# EAGLE design MainsFreqMon_RevA (EAGLE 7.2.0)
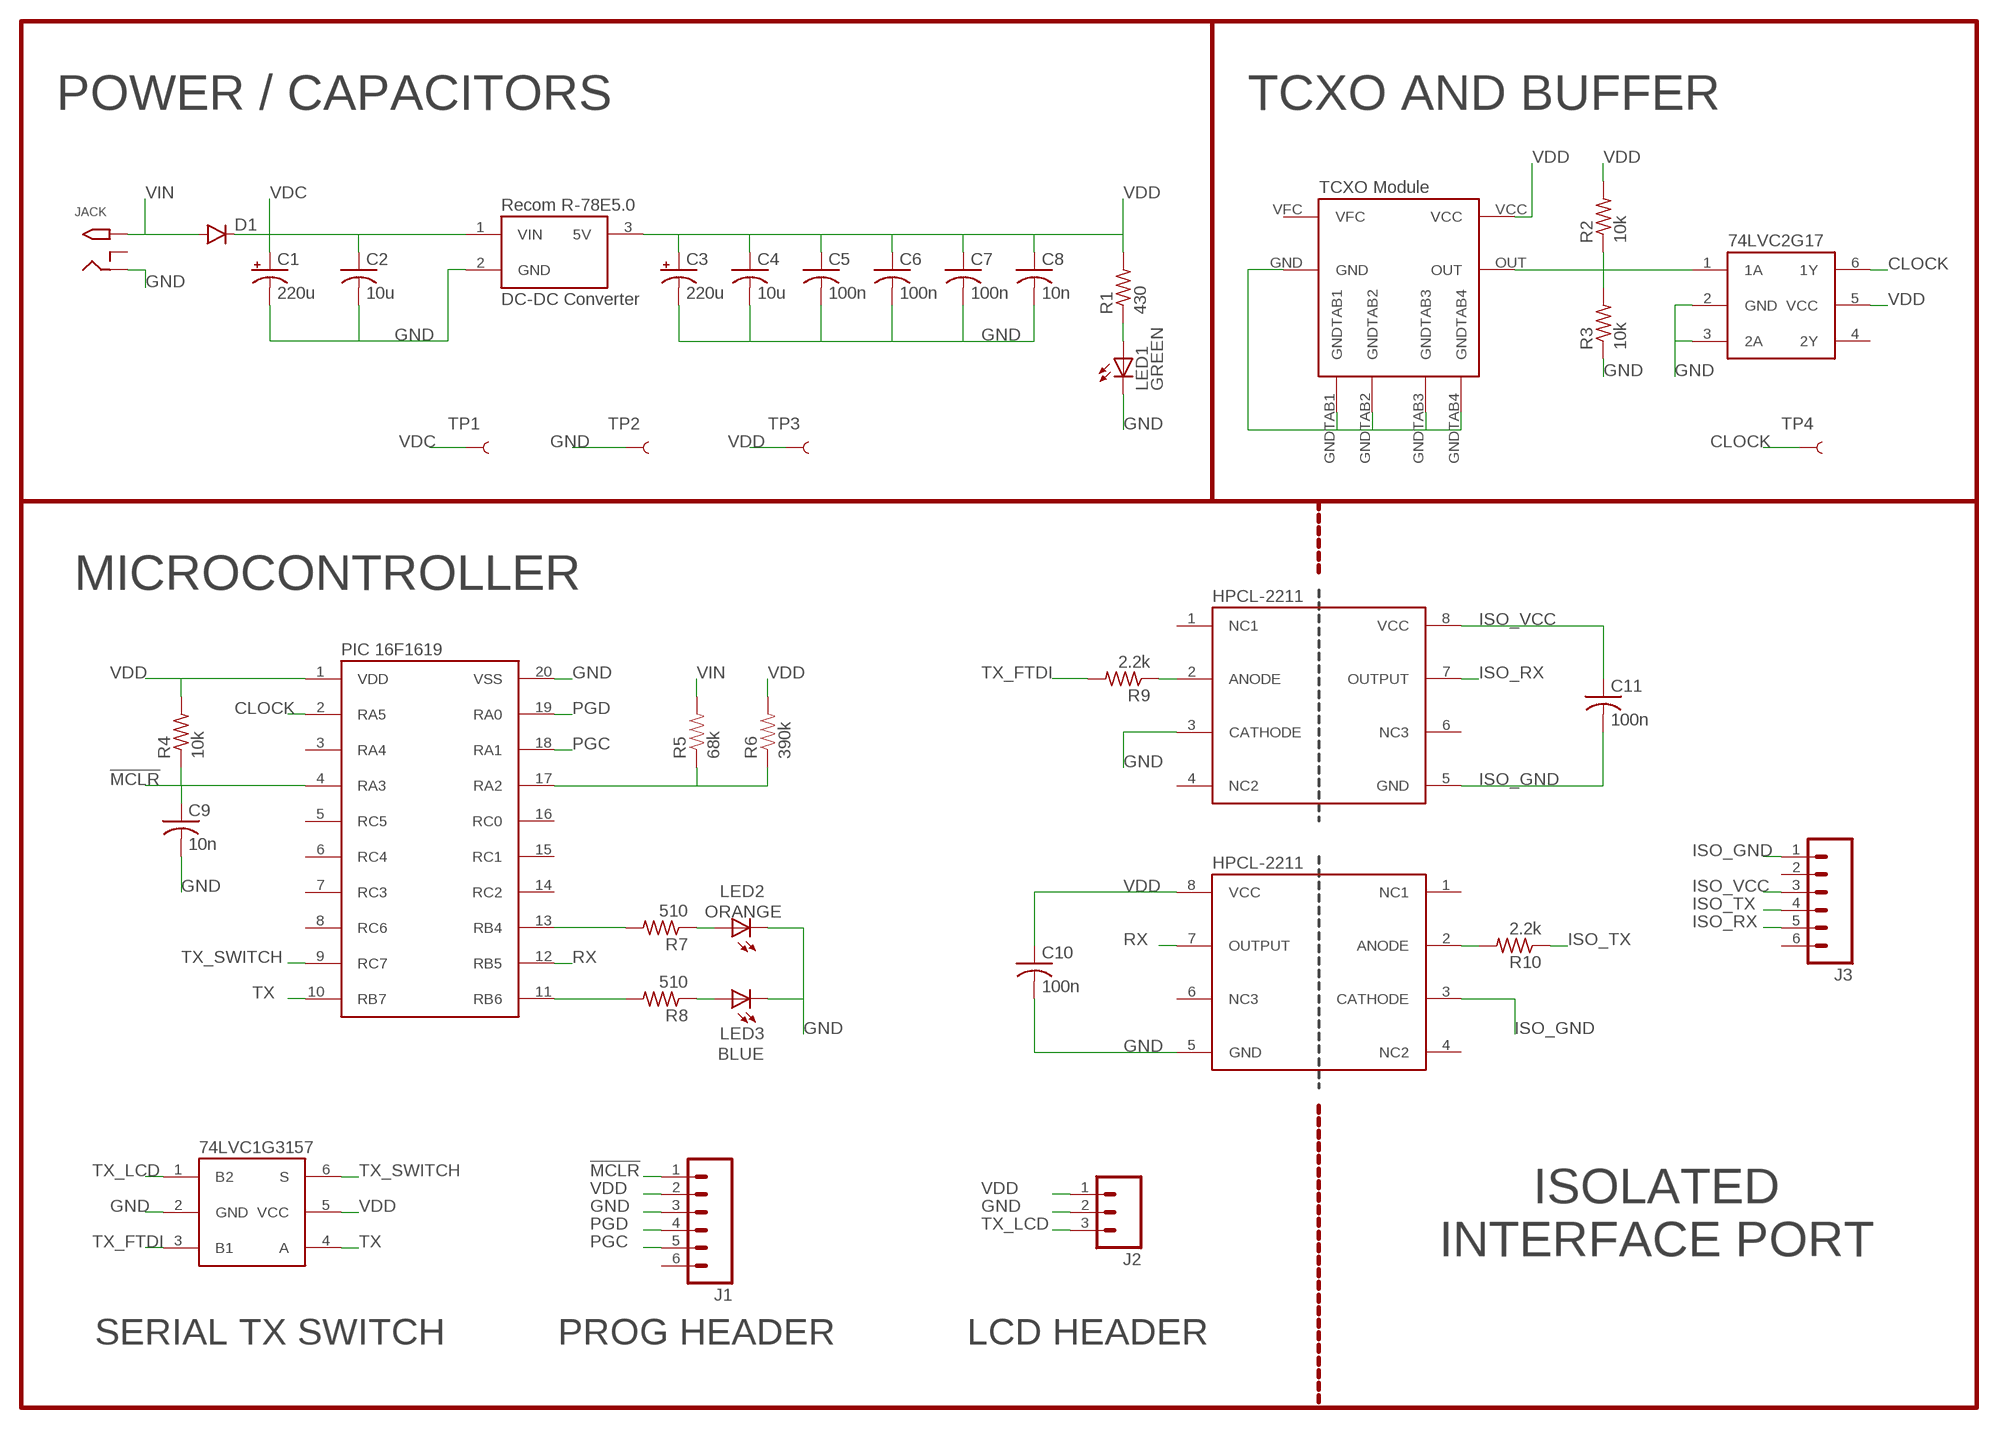
[diagram p0: schematic, sheet 1]

## Parts
C1  220u  CPOL-USE3.5-8  [E3,5-8]
C2  10u  C-USC0805  [C0805]
C3  220u  CPOL-USE3.5-8  [E3,5-8]
C4  10u  C-USC0805  [C0805]
C5  100n  C-USC0805  [C0805]
C6  100n  C-USC0805  [C0805]
C7  100n  C-USC0805  [C0805]
C8  10n  C-USC0805  [C0805]
C9  10n  C-USC0805  [C0805]
C10  100n  C-USC0805  [C0805]
C11  100n  C-USC0805  [C0805]
D1  DIODEPTH  [DIODE-1N4001]
J1  M06SILK_FEMALE_PTH  [1X06]
J2  M03PTH  [1X03]
J3  M06SILK_FEMALE_PTH  [1X06]
JACK  2.1MMJACKTHM  [PJ-102A]
LED1  GREEN  LEDCHIPLED_1206  [CHIPLED_1206]
LED2  ORANGE  LEDCHIPLED_1206  [CHIPLED_1206]
LED3  BLUE  LEDCHIPLED_1206  [CHIPLED_1206]
R1  430  R-US_R0805  [R0805]
R2  10k  R-US_R0805  [R0805]
R3  10k  R-US_R0805  [R0805]
R4  10k  R-US_R0805  [R0805]
R5  68k  RESISTORPTH-1/4W  [AXIAL-0.4]
R6  390k  RESISTORPTH-1/4W  [AXIAL-0.4]
R7  510  R-US_R0805  [R0805]
R8  510  R-US_R0805  [R0805]
R9  2.2k  R-US_R0805  [R0805]
R10  2.2k  R-US_R0805  [R0805]
RG1  R-78C5.0  [R-78C5.0]
TP1  TEST-POINT3X5  [PAD.03X.05]
TP2  TEST-POINT3X5  [PAD.03X.05]
TP3  TEST-POINT3X5  [PAD.03X.05]
TP4  TEST-POINT3X5  [PAD.03X.05]
U1  16F1619  [SO20L]
U2  74LVC2G14/7  [SOT23-6]
U3  74LVC1G3157  [SOT23-6]
U4  HPCL2211  [DIP08]
U5  HPCL2211  [DIP08]
X1  TCXO2  [TCXO2]

## Nets
!MCLR: C9.1 J1.1 R4.1 U1.4(RA3)
CLOCK: TP4.P$1 U1.2(RA5) U2.6(1Y)
GND: C1.- C2.2 C3.- C4.2 C5.2 C6.2 C7.2 C8.2 C9.2 C10.2 J1.3 J2.2 JACK.RING LED1.C LED2.C LED3.C R3.1 RG1.2(GND) TP2.P$1 U1.20(VSS) U2.2(GND) U2.3(2A) U3.2(GND) U4.3(CATHODE) U5.5(GND) X1.GND X1.GNDTAB1 X1.GNDTAB2 X1.GNDTAB3 X1.GNDTAB4
ISO_GND: C11.2 J3.1 U4.5(GND) U5.3(CATHODE)
ISO_RX: J3.5 U4.7(OUTPUT)
ISO_TX: J3.4 R10.1
ISO_VCC: C11.1 J3.3 U4.8(VCC)
N$1: R9.1 U4.2(ANODE)
N$2: LED1.A R1.1
N$4: R10.2 U5.2(ANODE)
N$5: R7.2 U1.13(RB4)
N$6: R2.1 R3.2 U2.1(1A) X1.OUT
N$7: R8.2 U1.11(RB6)
N$8: LED2.A R7.1
N$9: LED3.A R8.1
N$10: R5.P$1 R6.P$1 U1.17(RA2)
PGC: J1.5 U1.18(RA1)
PGD: J1.4 U1.19(RA0)
RX: U1.12(RB5) U5.7(OUTPUT)
TX: U1.10(RB7) U3.4(A)
TX_FTDI: R9.2 U3.3(B1)
TX_LCD: J2.3 U3.1(B2)
TX_SWITCH: U1.9(RC7) U3.6(S)
VDC: C1.+ C2.1 D1.C RG1.1(VIN) TP1.P$1
VDD: C3.+ C4.1 C5.1 C6.1 C7.1 C8.1 C10.1 J1.2 J2.1 R1.2 R2.2 R4.2 R6.P$2 RG1.3(5V) TP3.P$1 U1.1(VDD) U2.5(VCC) U3.5(VCC) U5.8(VCC) X1.VCC
VIN: D1.A JACK.TIP R5.P$2
Unconnected: J1.6 J3.2 J3.6 JACK.RING_SW U1.3(RA4) U1.5(RC5) U1.6(RC4) U1.7(RC3) U1.8(RC6) U1.14(RC2) U1.15(RC1) U1.16(RC0) U2.4(2Y) U4.1(NC1) U4.4(NC2) U4.6(NC3) U5.1(NC1) U5.4(NC2) U5.6(NC3) X1.VFC

## Notes on the sheet
- POWER / CAPACITORS | TCXO AND BUFFER
- TCXO Module
- Recom R-78E5.0
- 74LVC2G17
- DC-DC Converter
- MICROCONTROLLER
- HPCL-2211
- PIC 16F1619
- HPCL-2211
- 74LVC1G3157
- ISOLATED
  INTERFACE PORT
- SERIAL TX SWITCH | PROG HEADER | LCD HEADER

## Library data of the parts
C1 C3 = adafruit:CPOL-US: POLARIZED CAPACITOR, American symbol
C2 C4-C11 = adafruit:C-US: CAPACITOR, American symbol
D1 = SparkFun-DiscreteSemi:DIODE: Diode These are standard reverse protection diodes and small signal diodes. SMA package can handle up to about 1A. SOD-323 can handle about 200mA. What the SOD-323 package when ordering, there are some mfgs out there that are 5-pin packages.
J1 = SparkFun-ConnectorsNEW:M06: Header 6 Standard 6-pin 0.1" header. Use with straight break away headers (SKU : PRT-00116), right angle break away headers (PRT-00553), swiss pins (PRT-00743), machine pins (PRT-00117), and female headers (PRT-00115). Molex polarized connector foot print use with SKU : PRT-08094 with associated crimp pins and housings. NOTES ON THE VARIANTS LOCK and LOCK_LONGPADS... This footprint was designed to help hold the alignment of a through-hole component (i.e. 6-pin header) while soldering it into place. You may notice that each hole has been shifted either up or down by 0.005 of an inch from it's more standard position (which is a perfectly straight line). This slight alteration caused the pins (the squares in the middle) to touch the edges of the holes. Because they are alternating, it causes a "brace" to hold the component in place. 0.005 has proven to be the perfect amount of "off-center" position when using our standard breakaway headers. Although looks a little odd when you look at the bare footprint, once you have a header in there, the alteration is very hard to notice. Also,if you push a header all the way into place, it is covered up entirely on the bottom side. This idea of altering the position of holes to aid alignment will be further integrated into the Sparkfun Library for other footprints. It can help hold any component with 3 or more connection pins.; PROD_ID: CONN-08437
J2 = SparkFun-Connectors:M03: Header 3 Standard 3-pin 0.1" header. Use with straight break away headers (SKU : PRT-00116), right angle break away headers (PRT-00553), swiss pins (PRT-00743), machine pins (PRT-00117), and female headers (PRT-00115). Molex polarized connector foot print use with SKU : PRT-08232 with associated crimp pins and housings.
J3 = SparkFun-Connectors:M06: Header 6 Standard 6-pin 0.1" header. Use with straight break away headers (SKU : PRT-00116), right angle break away headers (PRT-00553), swiss pins (PRT-00743), machine pins (PRT-00117), and female headers (PRT-00115). Molex polarized connector foot print use with SKU : PRT-08094 with associated crimp pins and housings. NOTES ON THE VARIANTS LOCK and LOCK_LONGPADS... This footprint was designed to help hold the alignment of a through-hole component (i.e. 6-pin header) while soldering it into place. You may notice that each hole has been shifted either up or down by 0.005 of an inch from it's more standard position (which is a perfectly straight line). This slight alteration caused the pins (the squares in the middle) to touch the edges of the holes. Because they are alternating, it causes a "brace" to hold the component in place. 0.005 has proven to be the perfect amount of "off-center" position when using our standard breakaway headers. Although looks a little odd when you look at the bare footprint, once you have a header in there, the alteration is very hard to notice. Also,if you push a header all the way into place, it is covered up entirely on the bottom side. This idea of altering the position of holes to aid alignment will be further integrated into the Sparkfun Library for other footprints. It can help hold any component with 3 or more connection pins.; PROD_ID: CONN-08437
JACK = adafruit:2.1MMJACK: 2.1mm x 5.5mm THM DC jack with internal switch. Digikey part #PJ-102A, 4UCON part #05537 2.1mm x 5.5mm SMT DC jack with internal switch. Digikey part #PJ-002A-SMT, 4UCON part #03267 By microbuilder.eu & adafruit.com
LED1-LED3 = adafruit:LED: LED OSRAM: - CHIPLED LG R971, LG N971, LY N971, LG Q971, LY Q971, LO R971, LY R971 LH N974, LH R974 LS Q976, LO Q976, LY Q976 LO Q996 - Hyper CHIPLED LW Q18S LB Q993, LB Q99A, LB R99A - SideLED LS A670, LO A670, LY A670, LG A670, LP A670 LB A673, LV A673, LT A673, LW A673 LH A674 LY A675 LS A676, LA A676, LO A676, LY A676, LW A676 LS A679, LY A679, LG A679 - Hyper Micro SIDELED® LS Y876, LA Y876, LO Y876, LY Y876 LT Y87S - SmartLED LW L88C, LW L88S LB L89C, LB L89S, LG L890 LS L89K, LO L89K, LY L89K LS L896, LA L896, LO L896, LY L896 - TOPLED LS T670, LO T670, LY T670, LG T670, LP T670 LSG T670, LSP T670, LSY T670, LOP T670, LYG T670 LG T671, LOG T671, LSG T671 LB T673, LV T673, LT T673, LW T673 LH T674 LS T676, LA T676, LO T676, LY T676, LB T676, LH T676, LSB T676, LW T676 LB T67C, LV T67C, LT T67C, LS T67K, LO T67K, LY T67K, LW E67C LS E67B, LA E67B, LO E67B, LY E67B, LB E67C, LV E67C, LT E67C LW T67C LS T679, LY T679, LG T679 LS T770, LO T770, LY T770, LG T770, LP T770 LB T773, LV T773, LT T773, LW T773 LH T774 LS E675, LA E675, LY E675, LS T675 LS T776, LA T776, LO T776, LY T776, LB T776 LHGB T686 LT T68C, LB T68C - Hyper Mini TOPLED® LB M676 - Mini TOPLED Santana® LG M470 LS M47K, LO M47K, LY M47K Source: http://www.osram.convergy.de/
R1-R4 R7-R10 = adafruit:R-US_: RESISTOR, American symbol
R5 R6 = SparkFun-Resistors:RESISTOR: Resistor Basic schematic elements and footprints for 0603, 1206, and PTH resistors.
RG1 = _CustomParts:R-78C5.0
TP1-TP4 = SparkFun-Passives:TEST-POINT: Bare copper test points for troubleshooting or ICT
U1 = _CustomParts:16F1619
U2 = _CustomParts:74LVC2G14/7
U3 = _CustomParts:74LVC1G3157
U4 U5 = _CustomParts:HPCL2211
X1 = _CustomParts:TCXO2

## Board
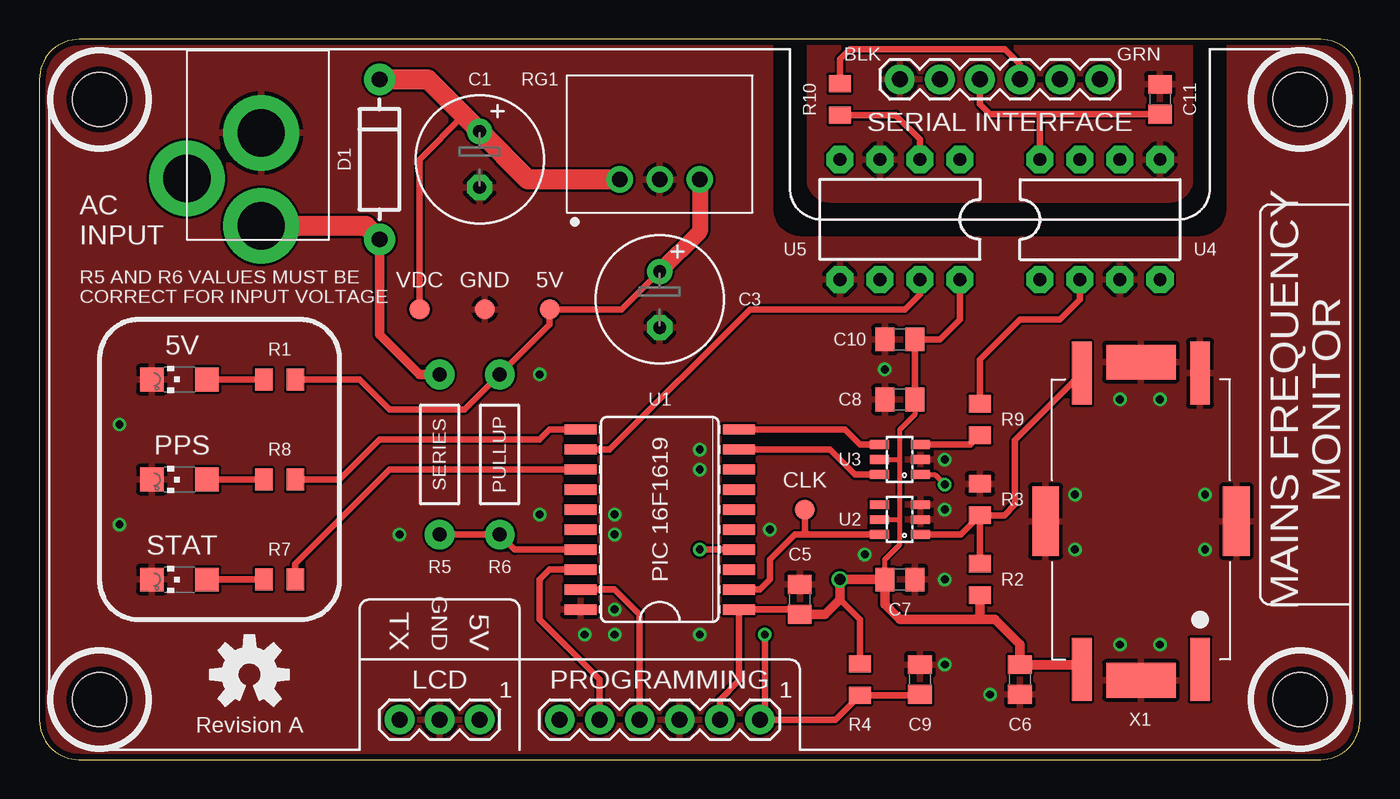
[diagram p1: board, top side]
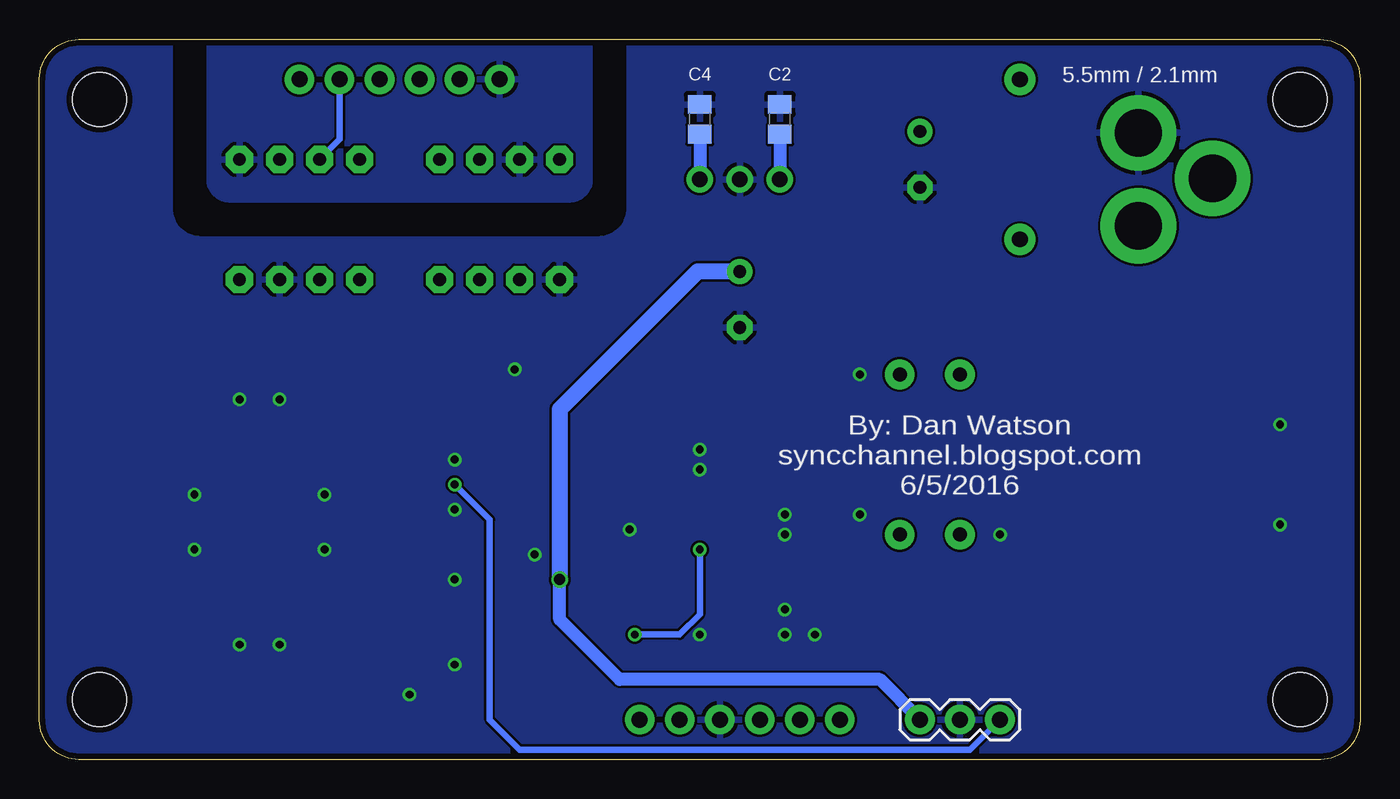
[diagram p2: board, bottom side, seen from below]

Size 83.82 x 45.72 mm. Coordinates in mm from the lower left corner, seen from the top.
Outline: 81.32,45.72 2.54,45.72 arc90 0,43.18 0,2.5 arc90 2.5,0 81.32,0 arc90 83.82,2.5 83.82,43.22 arc90 81.32,45.72
Copper layers (1*16): Top 0.0356mm / dielectric 1.5011mm / Bottom 0.0356mm
Design rules "oshpark-2layer *": minimum track width 6mil, minimum drill 13mil, track to track 6mil, track to pad 6mil, pad to pad 6mil, via to via 6mil, smd to smd 6mil, copper to edge 15mil, drill to drill 6mil, minimum pad ring 7mil, minimum via ring 7mil, stop-mask expansion 4mil, vias tented up to drill 20mil, thermal gap 10mil
Holes 3.4 mm at 3.81,41.91 80.01,41.91 80.01,3.81 3.81,3.81

### Footprints (pad centres in the part's own frame; a part is rotated, then mirrored left to right if it is on the bottom)
E3,5-8 = drill 0.813 pad 1.6: + -1.778,0 | drill 0.813 pad 1.6 octagon: - 1.778,0
C0805 = smd 1.2 x 1.5: 1 -0.95,0; 2 0.95,0
DIODE-1N4001 = drill 1 pad 1.981: A -5.08,0; C 5.08,0
1X06 = drill 1.016 pad 1.88: 1 0,0; 2 2.54,0; 3 5.08,0; 4 7.62,0; 5 10.16,0; 6 12.7,0
1X03 = drill 1.016 pad 1.88: 1 0,0; 2 2.54,0; 3 5.08,0
PJ-102A = drill 3 pad 4.8: RING 0.1,-3.39; RING_SW -4.6,-6.29; TIP 0.1,-9.29
CHIPLED_1206 = smd 1.5 x 1.5: A 0,-1.75; C 0,1.75
R0805 = smd 1.1 x 1.4: 1 -1,0; 2 1,0
AXIAL-0.4 = drill 0.9 pad 1.88: P$1 -5.08,0; P$2 5.08,0
R-78C5.0 = drill 1 pad 1.676: 1 -2.54,0; 2 0,0; 3 2.54,0
PAD.03X.05 = smd 1.27 x 1.27: P$1 0,0
SO20L = smd 0.66 x 2.032: 1 -5.715,-5.029; 2 -4.445,-5.029; 3 -3.175,-5.029; 4 -1.905,-5.029; 5 -0.635,-5.029; 6 0.635,-5.029; 7 1.905,-5.029; 8 3.175,-5.029; 9 4.445,-5.029; 10 5.715,-5.029; 11 5.715,5.029; 12 4.445,5.029; 13 3.175,5.029; 14 1.905,5.029; 15 0.635,5.029; 16 -0.635,5.029; 17 -1.905,5.029; 18 -3.175,5.029; 19 -4.445,5.029; 20 -5.715,5.029
SOT23-6 = smd 0.55 x 1.2: 1 -0.95,-1.3; 2 0,-1.3; 3 0.95,-1.3; 4 0.95,1.3; 5 0,1.3; 6 -0.95,1.3
DIP08 = drill 0.813 pad 1.727 octagon: 1 -3.81,-3.81; 2 -1.27,-3.81; 3 1.27,-3.81; 4 3.81,-3.81; 5 3.81,3.81; 6 1.27,3.81; 7 -1.27,3.81; 8 -3.81,3.81
TCXO2 = smd 1.25 x 4: GND 0,-0.4; OUT 7.5,-0.4; VCC 7.5,18.4; VFC 0,18.4 | smd 4.4 x 2.2: GNDTAB1 3.75,19.1; GNDTAB3 3.75,-1.1 | smd 1.7 x 4.4: GNDTAB2 -2.3,9; GNDTAB4 9.8,9

### Placement (x,y rotation side)
C1  27.94,38.1 270 top
C2  36.83,40.64 90 bottom
C3  39.37,29.21 270 top
C4  41.91,40.64 90 bottom
C5  48.26,10.16 90 top
C6  62.23,5.08 270 top
C7  54.61,11.43 0 top
C8  54.61,22.86 180 top
C9  55.88,5.08 90 top
C10  54.61,26.67 180 top
C11  71.12,41.91 90 top
D1  21.59,38.1 90 top
J1  45.72,2.54 180 top
J2  27.94,2.54 180 top
J3  54.61,43.18 0 top
JACK  13.97,43.18 0 top
LED1  8.89,24.13 90 top
LED2  8.89,11.43 90 top
LED3  8.89,17.78 90 top
R1  15.24,24.13 0 top
R2  59.69,11.43 270 top
R3  59.69,16.51 270 top
R4  52.07,5.08 90 top
R5  25.4,19.37 90 top
R6  29.21,19.37 90 top
R7  15.24,11.43 0 top
R8  15.24,17.78 0 top
R9  59.69,21.59 270 top
R10  50.8,41.91 270 top
RG1  39.37,36.83 0 top
TP1  24.13,28.57 0 top
TP2  28.26,28.57 0 top
TP3  32.38,28.57 0 top
TP4  48.58,15.88 0 top
U1  39.37,15.24 90 top
U2  54.61,15.24 90 top
U3  54.61,19.05 90 top
U4  67.31,34.29 0 top
U5  54.61,34.29 180 top
U$1  [OSHW-LOGO-M]  13.34,5.4 0 top
X1  73.66,24.13 180 top

### Tracks (layer width: path | path; a pad name or v marks a point on that pad's centre or on a via)
!MCLR  (via drill 0.5)
  Top 0.406: C9.1 55.83,4.08 R4.1 50.53,2.54 J1.1 46.04,3.17 v46.04,7.94 | U1.4 v41.91,13.34
  Bottom 0.406: v41.91,13.34 41.91,9.21 43.18,7.94 v46.04,7.94
CLOCK
  Top 0.406: 48.58,14.29 U2.6 | TP4.P$1 48.58,14.29 | U1.2 45.72,10.79 46.35,11.43 46.35,12.7 47.94,14.29 48.58,14.29
GND  (via drill 0.5)
  other vias: 57.47,19.05 57.47,15.88 34.61,7.94 36.51,7.94 36.51,9.53 52.39,13.02 57.47,11.43 57.47,6.03 53.66,24.77 68.58,22.86 71.12,22.86 71.12,7.3 68.58,7.3 65.72,13.34 65.72,16.83 73.98,16.83 73.98,13.34 5.08,21.27 5.08,14.92 46.35,14.61 41.91,7.94 41.91,19.68 41.91,18.41 31.75,15.56 31.75,24.45 22.86,14.29 36.51,15.56 36.51,14.29 60.33,4.13
  pour Top: 46.35,46.99 46.35,35.02 arc90 48.35,33.02 73.56,33.02 arc90 75.56,35.02 75.56,46.99 85.09,46.99 85.09,-3.81 -2.54,-3.81 -2.54,46.99
  pour Bottom: 46.35,46.99 -2.54,46.99 -2.54,-3.81 85.09,-3.81 85.09,46.99 75.56,46.99 75.56,35.02 arc-90 73.56,33.02 48.35,33.02 arc-90 46.35,35.02
ISO_GND
  pour Bottom: 48.9,46.99 48.9,36.83 arc90 50.16,35.56 71.75,35.56 arc90 73.03,36.83 73.03,46.99
  pour Top: 48.9,46.99 48.9,36.83 arc90 50.16,35.56 71.75,35.56 arc90 73.03,36.83 73.03,46.99
ISO_RX
  Bottom 0.406: J3.5 64.77,39.37 U4.7
ISO_TX
  Top 0.406: J3.4 62.23,44.13 61.28,45.09 51.44,45.09 50.8,44.45 R10.1
ISO_VCC
  Top 0.406: C11.1 63.5,40.96 | 63.5,40.96 60.32,40.96 59.69,41.59 J3.3 | U4.8 63.5,40.96
N$1
  Top 0.406: U4.2 66.04,29.21 64.77,27.94 62.23,27.94 59.69,25.4 R9.1
N$2
  Top 0.406: LED1.A R1.1
N$4
  Top 0.406: R10.2 54.34,40.91 55.88,39.37 U5.2
N$5
  Top 0.406: U1.13 22.23,18.41 16.24,12.43 R7.2
N$6
  Top 0.406: R3.2 61.23,15.51 61.91,16.19 61.91,20.28 X1.OUT | R2.1 R3.2 | U2.1 58.47,14.29 R3.2
N$7
  Top 0.406: R8.2 19.05,17.78 21.59,20.32 31.75,20.32 32.38,20.95 U1.11
N$8
  Top 0.406: LED2.A R7.1
N$9
  Top 0.406: LED3.A R8.1
N$10
  Top 0.406: U1.17 30.16,13.34 R6.P$1 R5.P$1
PGC
  Top 0.406: U1.18 32.38,12.06 31.75,11.43 31.75,8.89 35.56,5.08 J1.5
PGD
  Top 0.406: U1.19 36.51,10.79 38.1,9.21 J1.4
RX
  Top 0.406: U5.7 55.88,29.53 54.93,28.57 45.09,28.57 36.2,19.68 U1.12
TX
  Top 0.406: U1.10 51.12,20.95 52.07,20 U3.4
TX_FTDI
  Top 0.406: U3.3 59.1,20 R9.2
TX_LCD  (via drill 0.5)
  Top 0.305: U3.1 56.83,18.1 v57.47,17.46
  Bottom 0.406: J2.3 24.77,0.64 53.34,0.64 55.24,2.54 55.24,15.24 v57.47,17.46
TX_SWITCH
  Top 0.406: U1.9 50.16,19.68 51.75,18.1 U3.6
VDC
  Top 0.406: TP1.P$1 24.13,38.1 26.92,40.89
  Top 1.27: D1.C 24.64,43.18 26.92,40.89 C1.+ 30.99,36.83 RG1.1
  Bottom 0.813: C2.1 RG1.1
VDD  (via drill 0.7)
  Top 0.305: C7.1 53.66,12.7 54.61,13.65 54.61,15.24 | C8.1 55.56,21.91 54.61,20.95 54.61,19.05 | 54.61,15.24 54.61,19.05 | U3.5 54.61,19.05 | U2.5 54.61,15.24
  Top 0.406: C3.+ 36.96,28.57 TP3.P$1 32.38,27.62 R6.P$2 26.99,22.23 22.23,22.23 20.32,24.13 R1.2 | U5.8 58.42,27.94 57.15,26.67 C10.1 C8.1 | C5.1 47.95,9.53 U1.1 44.4,5.03 43.18,3.81 J1.2 | R4.2 52.07,8.89 50.8,10.16
  Top 0.61: X1.VCC 65.86,6.03 C6.1 62.23,7.3 60.64,8.89 59.69,8.89 | 59.69,8.89 R2.2 | 59.69,8.89 54.61,8.89 53.66,9.84 C7.1 v50.8,11.43 50.8,10.16 49.85,9.21 C5.1
  Top 1.016: RG1.3 41.91,33.53 C3.+
  Bottom 0.813: C4.1 RG1.3 | J2.1 30.48,5.08 46.99,5.08 50.8,8.89 v50.8,11.43
  Bottom 1.016: C3.+ 42.04,30.99 50.8,22.23 v50.8,11.43
VIN
  Top 0.61: R5.P$2 24.13,24.45 21.59,26.99 D1.A
  Top 1.27: JACK.TIP 20.72,33.89 D1.A

### Text on the board
tNames: BLK | GRN | C1 | RG1 | R10 | C11 | SERIAL INTERFACE | D1 | AC / INPUT | U5 | U4 | R5 AND R6 VALUES MUST BE / CORRECT FOR INPUT VOLTAGE | VDC | GND | 5V | C3 | C10 | 5V | R1 | U1 | C8 | MAINS FREQUENCY / MONITOR | R9 | PPS | R8 | SERIES | PULLUP | U3 | CLK | R3 | PIC 16F1619 | U2 | STAT | R7 | C5 | R5 | R6 | R2 | C7 | TX | GND | 5V | LCD | PROGRAMMING | 1 | 1 | X1 | Revision A | R4 | C9 | C6
bNames: 5.5mm / 2.1mm | C2 | C4 | By: Dan Watson / syncchannel.blogspot.com / 6/5/2016